# EasyEDA schematic SCH_SEGA-BackUp-Ram_EasyEDA.json
TITLE: Sega Back Up RAM MegaCD; REV: 1.2; Date: 2026-09-27; Sheet: 1/1; Drawn By: Ezechielxae; Company: Ezechielxae, Co
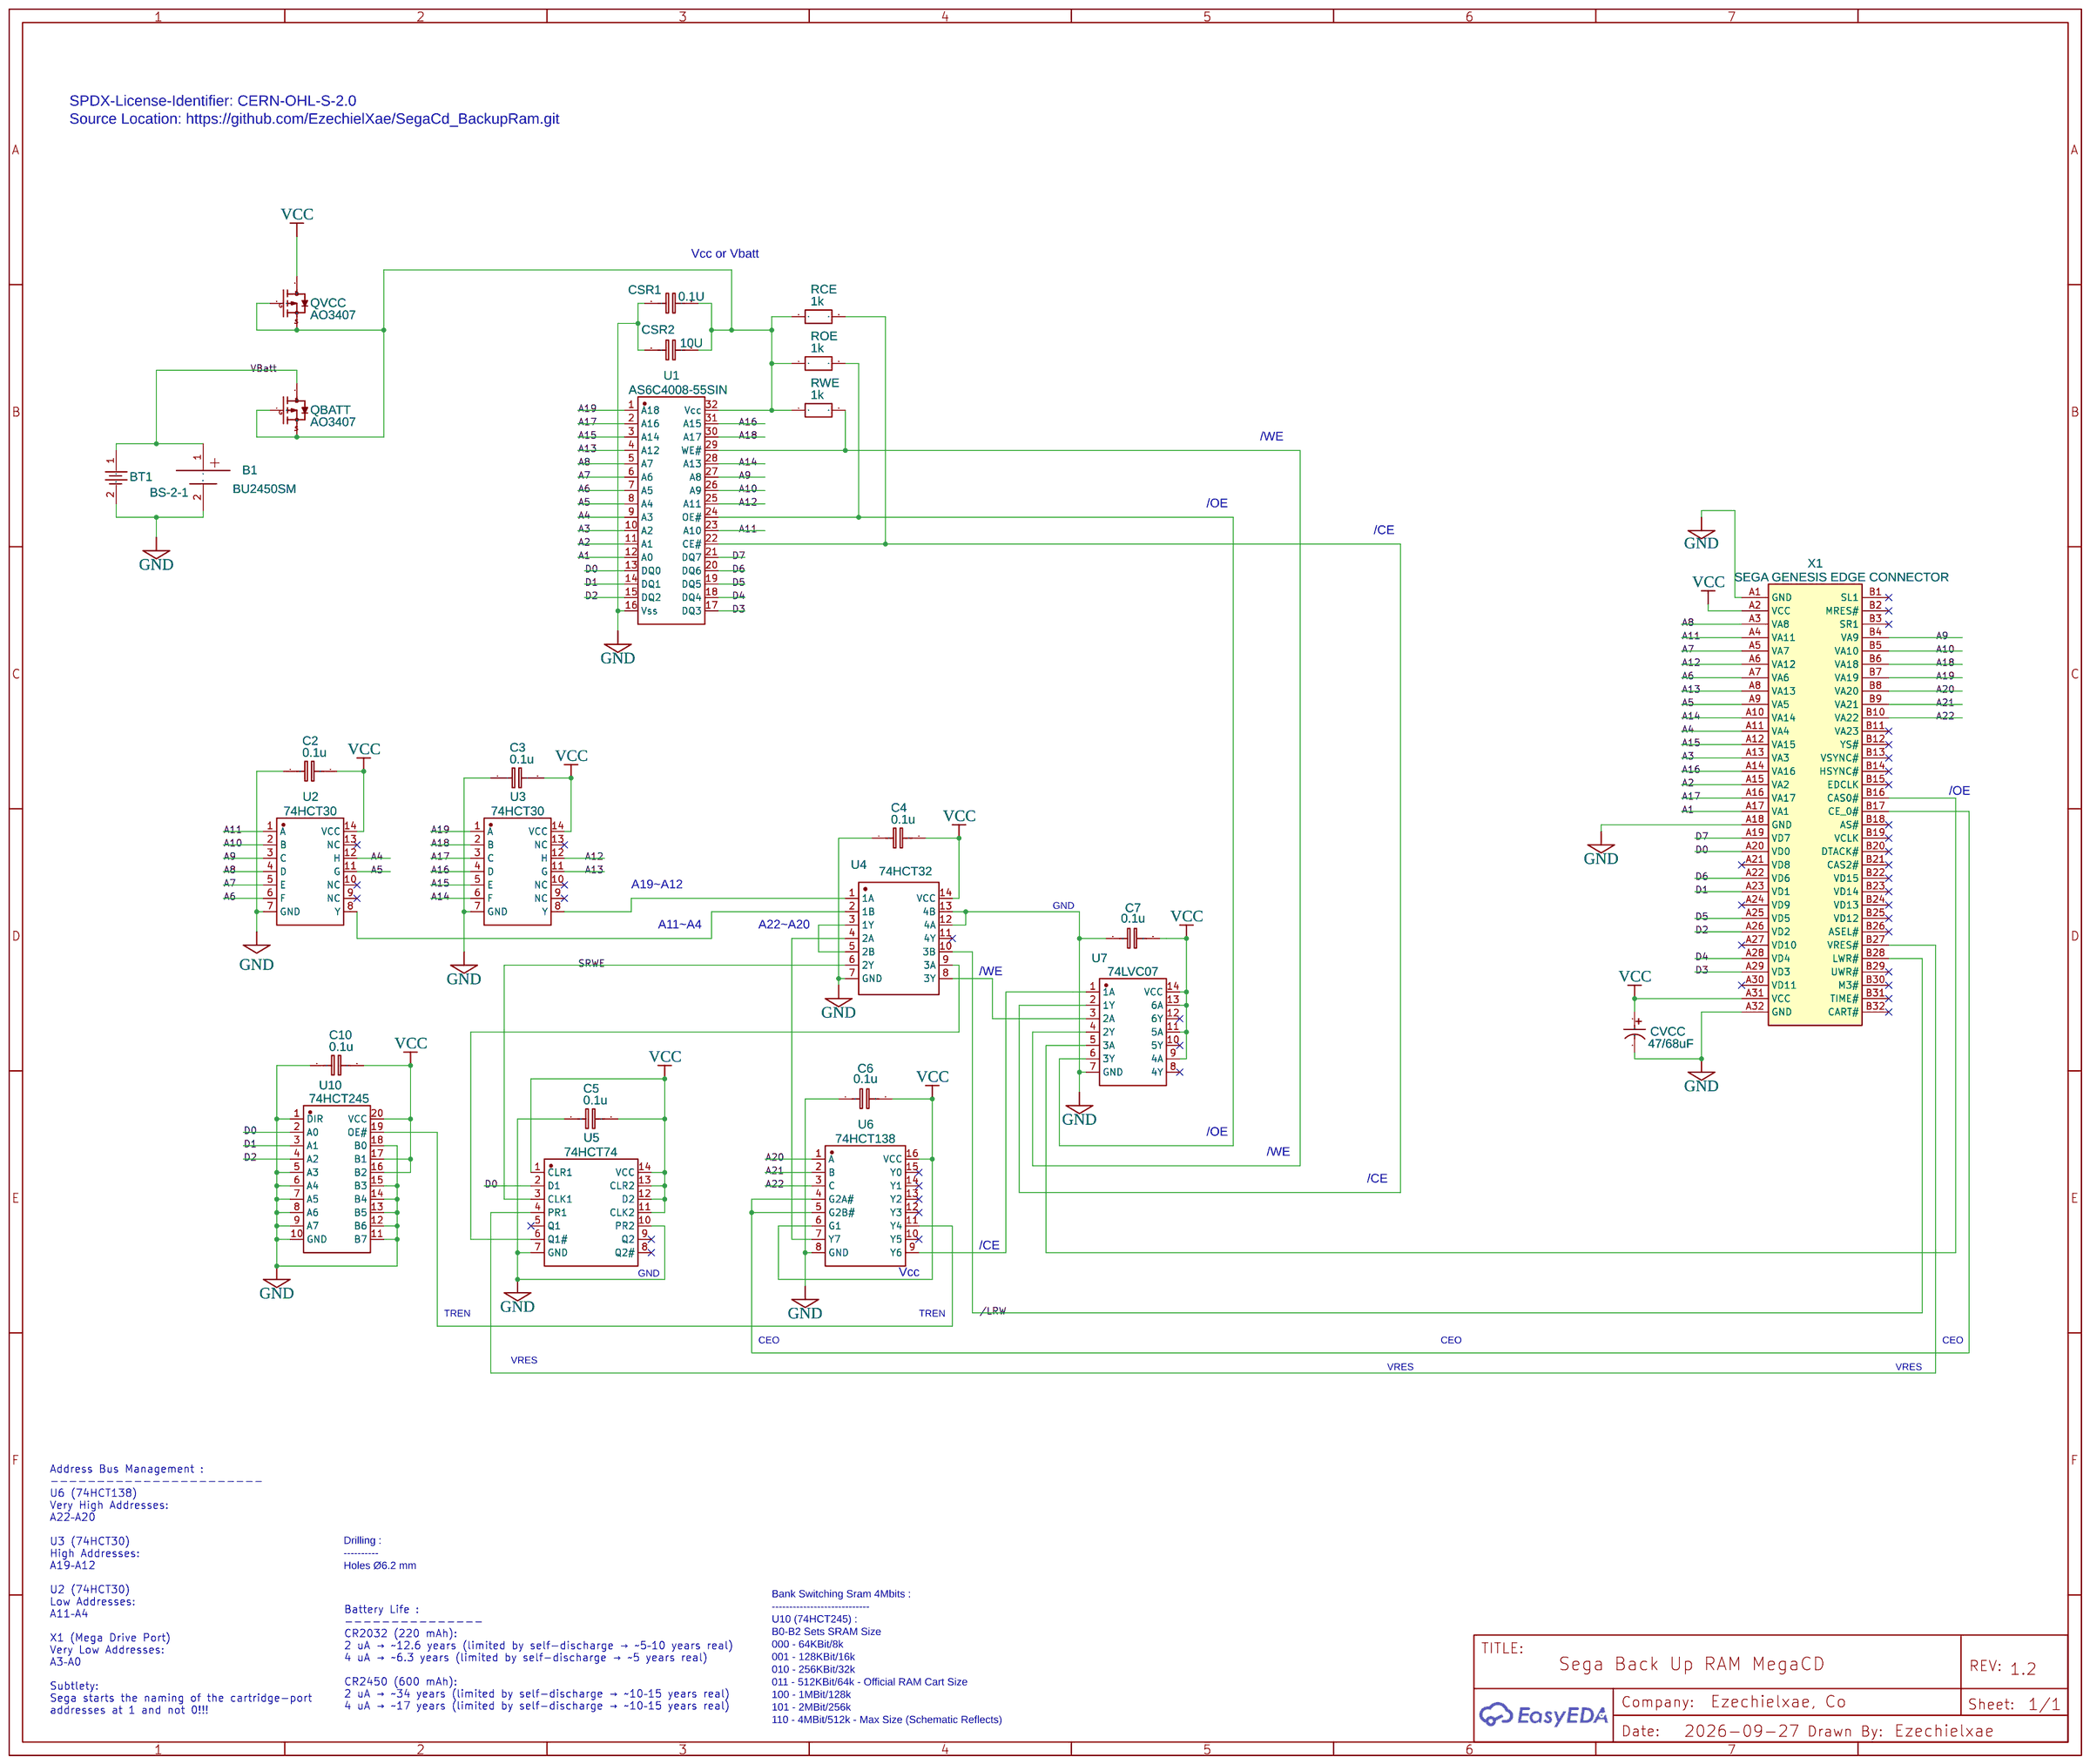
[diagram p0: schematic sheet]

## Parts
B1  BU2450SM  [BU2450SM-JJ-GTR]
BT1  BS-2-1  [BAT-TH_BS-2-1]
C2  0.1u  [C0805]
C3  0.1u  [C0805]
C4  0.1u  [C0805]
C5  0.1u  [C0805]
C6  0.1u  [C0805]
C7  0.1u  [C0805]
C10  0.1u  [C0805]
CSR1  0.1U  [C1206]
CSR2  10U  [C1206]
CVCC  47/68uF  [CAP-TH_BD6.3-P2.50-D1.0-FD]
QBATT  AO3407  [SOT-23-3_L2.9-W1.6-P1.90-LS2.8-BR]
QVCC  AO3407  [SOT-23-3_L2.9-W1.6-P1.90-LS2.8-BR]
RCE  1k  [R1206]
ROE  1k  [R1206]
RWE  1k  [R1206]
U1  AS6C4008-55SIN  [SOP-32_L20.7-W11.3-P1.27-LS14.1-BL]
U2  74HCT30  [SOIC-14_L8.7-W3.9-P1.27-LS6.0-BL]
U3  74HCT30  [SOIC-14_L8.7-W3.9-P1.27-LS6.0-BL]
U4  74HCT32  [SOIC-14_L8.7-W3.9-P1.27-LS6.0-BL]
U5  74HCT74  [SOIC-14_L8.6-W3.9-P1.27-LS6.0-BL]
U6  74HCT138  [SOIC-16_L9.9-W3.8-P1.27-LS6.0-BL]
U7  74LVC07  [SOIC-14_L8.7-W3.9-P1.27-LS6.0-BL]
U10  74HCT245  [SO-20_L12.8-W7.5-P1.27-LS10.3-BL]
X1  SEGA GENESIS EDGE CONNECTOR  [SEGA GENESIS CARTRIDGE EDGE CONNETOR]

## Library data of the parts
B1 = BU2450SM: Manufacturer Part: BU2450-JJ-GTR; Supplier: batteryholders.com; Contributor: kenjewell
BT1 = BS-2-1: Contributor: LCSC; Supplier: LCSC; Supplier Part: C2895401; Manufacturer: QIJEY; JLCPCB Part Class: Extended Part
C2-C7 C10 CSR1 CSR2 = C_1206_EU: Contributor: LCEDA_Lib
CVCC = 68uF 50V 6.3*12: Supplier: LCSC; Manufacturer: Chengx(承兴); Manufacturer Part: KM686M050E12RR0VH2FP0; Supplier Part: C47859; JLCPCB Part Class: Extended Part
QBATT QVCC = AO3407_C4748726: Contributor: lcsc; Supplier: LCSC; Supplier Part: C4748726; Manufacturer: HXY MOSFET(华轩阳电子); Manufacturer Part: AO3407-HXY; JLCPCB Part Class: Extended Part
RCE ROE RWE = R_1206_EU: Contributor: LCEDA_Lib
U1 = AS6C4008-55SIN: Contributor: lcsc; Supplier: LCSC; Supplier Part: C1350086; Manufacturer: Alliance Memory; JLCPCB Part Class: Extended Part
U2 U3 = CD74HCT30M96: Contributor: LCSC; Supplier: LCSC; Supplier Part: C2865549; Manufacturer: TI(德州仪器); JLCPCB Part Class: Extended Part
U4 = SN74HCT32DR: Supplier: LCSC; Manufacturer: TI(德州仪器); Supplier Part: C6781; JLCPCB Part Class: Extended Part
U5 = MM74HCT74M: Contributor: LCSC; Supplier: LCSC; Supplier Part: C897306; Manufacturer: onsemi(安森美); JLCPCB Part Class: Extended Part
U6 = CD74HCT138M: Contributor: LCSC; Supplier: LCSC; Supplier Part: C1547128; Manufacturer: TI(德州仪器); JLCPCB Part Class: Extended Part
U7 = SN74LVC07ADT: Contributor: LCSC; Supplier: LCSC; Supplier Part: C1848198; Manufacturer: TI(德州仪器); JLCPCB Part Class: Extended Part
U10 = 74HCT245D,652: Contributor: LCSC; Supplier: LCSC; Supplier Part: C547498; Manufacturer: Nexperia(安世); JLCPCB Part Class: Extended Part
X1 = SEGA GENESIS EDGE CONNECTOR: Contributor: Stargazer24

## Nets
GND: B1.2 BT1.2 C2.1 C3.1 C4.1 C5.1 C6.1 C7.1 C10.1 CSR1.1 CSR2.1 CVCC.2 U1.16(Vss) U2.7(GND) U3.7(GND) U4.7(GND) U4.12(4A) U4.13(4B) U5.7(GND) U5.10(PR2) U6.8(GND) U7.7(GND) U10.1(DIR) U10.5(A3) U10.6(A4) U10.7(A5) U10.8(A6) U10.9(A7) U10.10(GND) U10.11(B7) U10.12(B6) U10.13(B5) U10.14(B4) U10.15(B3) U10.18(B0) X1.A1(GND) X1.A18(GND) X1.A32(GND)
VBatt: B1.1 BT1.1 QBATT.3(D)
VCC: C2.2 C3.2 C4.2 C5.2 C6.2 C7.2 C10.2 CVCC.1 QVCC.3(D) U2.14(VCC) U3.14(VCC) U4.14(VCC) U5.1(CLR1) U5.11(CLK2) U5.12(D2) U5.13(CLR2) U5.14(VCC) U6.6(G1) U6.16(VCC) U7.9(4A) U7.11(5A) U7.13(6A) U7.14(VCC) U10.16(B2) U10.17(B1) U10.20(VCC) X1.A2(VCC) X1.A31(VCC)
/LRW: U4.10(3B) X1.B28(LWR#)
A1: U1.12(A0) X1.A17(VA1)
A2: U1.11(A1) X1.A15(VA2)
A3: U1.10(A2) X1.A13(VA3)
A4: U1.9(A3) U2.12(H) X1.A11(VA4)
A5: U1.8(A4) U2.11(G) X1.A9(VA5)
A6: U1.7(A5) U2.6(F) X1.A7(VA6)
A7: U1.6(A6) U2.5(E) X1.A5(VA7)
A8: U1.5(A7) U2.4(D) X1.A3(VA8)
A9: U1.27(A8) U2.3(C) X1.B4(VA9)
A10: U1.26(A9) U2.2(B) X1.B5(VA10)
A11: U1.23(A10) U2.1(A) X1.A4(VA11)
A12: U1.25(A11) U3.12(H) X1.A6(VA12)
A13: U1.4(A12) U3.11(G) X1.A8(VA13)
A14: U1.28(A13) U3.6(F) X1.A10(VA14)
A15: U1.3(A14) U3.5(E) X1.A12(VA15)
A16: U1.31(A15) U3.4(D) X1.A14(VA16)
A17: U1.2(A16) U3.3(C) X1.A16(VA17)
A18: U1.30(A17) U3.2(B) X1.B6(VA18)
A19: U1.1(A18) U3.1(A) X1.B7(VA19)
A20: U6.1(A) X1.B8(VA20)
A21: U6.2(B) X1.B9(VA21)
A22: U6.3(C) X1.B10(VA22)
D0: U1.13(DQ0) U5.2(D1) U10.2(A0) X1.A20(VD0)
D1: U1.14(DQ1) U10.3(A1) X1.A23(VD1)
D2: U1.15(DQ2) U10.4(A2) X1.A26(VD2)
D3: U1.17(DQ3) X1.A29(VD3)
D4: U1.18(DQ4) X1.A28(VD4)
D5: U1.19(DQ5) X1.A25(VD5)
D6: U1.20(DQ6) X1.A22(VD6)
D7: U1.21(DQ7) X1.A19(VD7)
SRWE: U4.6(2Y) U5.3(CLK1)
Net-(CSR1-2): CSR1.2 CSR2.2 QBATT.1(G) QBATT.2(S) QVCC.1(G) QVCC.2(S) RCE.1 ROE.1 RWE.1 U1.32(Vcc)
Net-(RCE-2): RCE.2 U1.22(CE#) U7.2(1Y)
Net-(ROE-2): ROE.2 U1.24(OE#) U7.6(3Y)
Net-(RWE-2): RWE.2 U1.29(WE#) U7.4(2Y)
Net-(U2-8): U2.8(Y) U4.2(1B)
Net-(U3-8): U3.8(Y) U4.1(1A)
Net-(U4-3): U4.3(1Y) U4.5(2B)
Net-(U4-4): U4.4(2A) U6.7(Y7)
Net-(U4-8): U4.8(3Y) U7.3(2A)
Net-(U4-9): U4.9(3A) U5.6(Q1#)
Net-(U5-4): U5.4(PR1) X1.B27(VRES#)
Net-(U6-4): U6.4(G2A#) U6.5(G2B#) X1.B17(CE_0#)
Net-(U6-9): U6.9(Y6) U7.1(1A)
Net-(U6-11): U6.11(Y4) U10.19(OE#)
Net-(U7-5): U7.5(3A) X1.B16(CAS0#)

Not connected (* = marked no-connect by the designer): U2 9(NC)* 10(NC)* 13(NC)*; U3 9(NC)* 10(NC)* 13(NC)*; U4 11(4Y)*; U5 5(Q1)* 8(Q2#)* 9(Q2)*; U6 10(Y5)* 12(Y3)* 13(Y2)* 14(Y1)* 15(Y0)*; U7 8(4Y)* 10(5Y)* 12(6Y)*; X1 A21(VD8)* A24(VD9)* A27(VD10)* A30(VD11)* B1(SL1)* B2(MRES#)* B3(SR1)* B11(VA23)* B12(YS#)* B13(VSYNC#)* B14(HSYNC#)* B15(EDCLK)* B18(AS#)* B19(VCLK)* B20(DTACK#)* B21(CAS2#)* B22(VD15)* B23(VD14)* B24(VD13)* B25(VD12)* B26(ASEL#)* B29(UWR#)* B30(M3#)* B31(TIME#)* B32(CART#)*

## Notes on the sheet
- SPDX-License-Identifier: CERN-OHL-S-2.0
  Source Location: https://github.com/EzechielXae/SegaCd_BackupRam.git
- Vcc or Vbatt
- /WE
- /OE
- /CE
- /OE
- A19~A12
- GND
- A11~A4
- A22~A20
- /WE
- /OE
- /WE
- /CE
- /CE
- GND
- Vcc
- TREN
- TREN
- CEO
- CEO
- CEO
- VRES
- VRES
- VRES
- Address Bus Management :
  -----------------------
  U6 (74HCT138)
  Very High Addresses:
  A22–A20
  U3 (74HCT30)
  High Addresses:
  A19–A12
  U2 (74HCT30)
  Low Addresses:
  A11–A4
  X1 (Mega Drive Port)
  Very Low Addresses:
  A3–A0
  Subtlety:
  Sega starts the naming of the cartridge-port
  addresses at 1 and not 0!!!
- Drilling :
  ----------
  Holes Ø6.2 mm
- Bank Switching Sram 4Mbits :
  ----------------------------
  U10 (74HCT245) :
  B0-B2 Sets SRAM Size
  000 - 64KBit/8k
  001 - 128KBit/16k
  010 - 256KBit/32k
  011 - 512KBit/64k - Official RAM Cart Size
  100 - 1MBit/128k
  101 - 2MBit/256k
  110 - 4MBit/512k - Max Size (Schematic Reflects)
- Battery Life :
  ---------------
  CR2032 (220 mAh):
  2 uA → ~12.6 years (limited by self-discharge → ~5–10 years real)
  4 uA → ~6.3 years (limited by self-discharge → ~5 years real)
  CR2450 (600 mAh):
  2 uA → ~34 years (limited by self-discharge → ~10–15 years real)
  4 uA → ~17 years (limited by self-discharge → ~10–15 years real)
